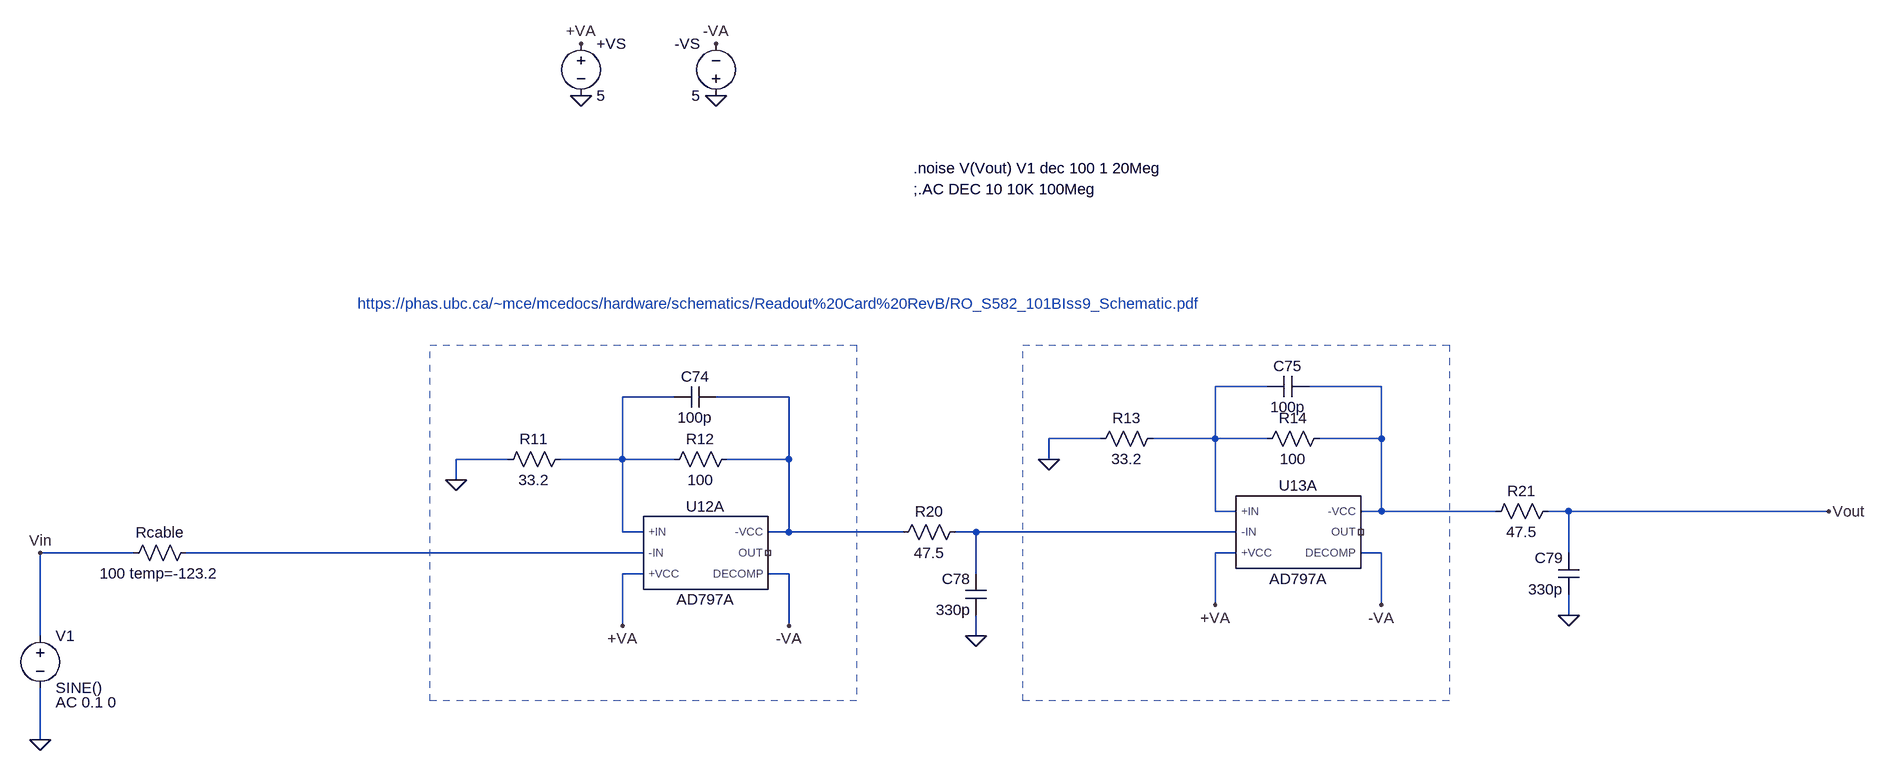
[diagram p0: schematic mce_rc_revb_frontend.asc]
mce_rc_revb_frontend.asc, the LTspice schematic file:
Version 4
SHEET 1 2228 836
WIRE 1296 112 1216 112
WIRE 1472 112 1360 112
WIRE 384 128 304 128
WIRE 560 128 448 128
WIRE 1040 192 960 192
WIRE 1216 192 1216 112
WIRE 1216 192 1120 192
WIRE 1296 192 1216 192
WIRE 1472 192 1472 112
WIRE 1472 192 1376 192
WIRE 128 224 48 224
WIRE 304 224 304 128
WIRE 304 224 208 224
WIRE 384 224 304 224
WIRE 560 224 560 128
WIRE 560 224 464 224
WIRE 960 224 960 192
WIRE 48 256 48 224
WIRE 1216 304 1216 192
WIRE 1248 304 1216 304
WIRE 1472 304 1472 192
WIRE 1472 304 1440 304
WIRE 1648 304 1472 304
WIRE 1760 304 1728 304
WIRE 2160 304 1760 304
WIRE 304 336 304 224
WIRE 336 336 304 336
WIRE 560 336 560 224
WIRE 560 336 528 336
WIRE 736 336 560 336
WIRE 848 336 816 336
WIRE 1248 336 848 336
WIRE -448 368 -592 368
WIRE 336 368 -368 368
WIRE 1248 368 1216 368
WIRE 1472 368 1440 368
WIRE 1760 368 1760 304
WIRE 336 400 304 400
WIRE 560 400 528 400
WIRE 848 400 848 336
WIRE 1216 448 1216 368
WIRE 1472 448 1472 368
WIRE 1760 464 1760 432
WIRE 304 480 304 400
WIRE 560 480 560 400
WIRE -592 496 -592 368
WIRE 848 496 848 464
WIRE -592 656 -592 576
FLAG -592 656 0
FLAG 48 256 0
FLAG 2160 304 Vout
FLAG -592 368 Vin
FLAG 240 -336 0
FLAG 448 -336 0
FLAG 240 -416 +VA
FLAG 448 -416 -VA
FLAG 304 480 +VA
FLAG 560 480 -VA
FLAG 848 496 0
FLAG 1216 448 +VA
FLAG 1472 448 -VA
FLAG 960 224 0
FLAG 1760 464 0
SYMBOL AutoGenerated/AD797A 432 368 R0
SYMATTR InstName U12A
SYMBOL voltage 240 -432 R0
SYMATTR InstName +VS
SYMATTR Value 5
SYMATTR SpiceLine Rser=0
SYMBOL voltage 448 -320 R180
WINDOW 0 24 96 Left 2
WINDOW 3 24 16 Left 2
SYMATTR InstName -VS
SYMATTR Value 5
SYMATTR SpiceLine Rser=0
SYMBOL voltage -592 480 R0
WINDOW 123 24 118 Left 2
SYMATTR Value2 AC 0.1 0
SYMATTR InstName V1
SYMATTR Value SINE()
SYMBOL res 224 208 R90
WINDOW 0 0 56 VBottom 2
WINDOW 3 32 56 VTop 2
SYMATTR InstName R11
SYMATTR Value 33.2
SYMBOL res 480 208 R90
WINDOW 0 0 56 VBottom 2
WINDOW 3 32 56 VTop 2
SYMATTR InstName R12
SYMATTR Value 100
SYMBOL cap 448 112 R90
WINDOW 0 0 32 VBottom 2
WINDOW 3 32 32 VTop 2
SYMATTR InstName C74
SYMATTR Value 100p
SYMBOL res -352 352 R90
WINDOW 0 0 56 VBottom 2
WINDOW 3 32 56 VTop 2
SYMATTR InstName Rcable
SYMATTR Value 100 temp=-123.2
SYMBOL res 832 320 R90
WINDOW 0 0 56 VBottom 2
WINDOW 3 32 56 VTop 2
SYMATTR InstName R20
SYMATTR Value 47.5
SYMBOL cap 864 464 R180
WINDOW 0 24 56 Left 2
WINDOW 3 24 8 Left 2
SYMATTR InstName C78
SYMATTR Value 330p
SYMBOL AutoGenerated/AD797A 1344 336 R0
SYMATTR InstName U13A
SYMBOL res 1136 176 R90
WINDOW 0 0 56 VBottom 2
WINDOW 3 32 56 VTop 2
SYMATTR InstName R13
SYMATTR Value 33.2
SYMBOL cap 1360 96 R90
WINDOW 0 0 32 VBottom 2
WINDOW 3 32 32 VTop 2
SYMATTR InstName C75
SYMATTR Value 100p
SYMBOL res 1392 176 R90
WINDOW 0 0 56 VBottom 2
WINDOW 3 32 56 VTop 2
SYMATTR InstName R14
SYMATTR Value 100
SYMBOL res 1744 288 R90
WINDOW 0 0 56 VBottom 2
WINDOW 3 32 56 VTop 2
SYMATTR InstName R21
SYMATTR Value 47.5
SYMBOL cap 1776 432 R180
WINDOW 0 24 56 Left 2
WINDOW 3 24 8 Left 2
SYMATTR InstName C79
SYMATTR Value 330p
TEXT 752 -192 Left 2 !;.AC DEC 10 10K 100Meg
TEXT 752 -224 Left 2 !.noise V(Vout) V1 dec 100 1 20Meg
TEXT -104 -16 Left 2 ;https://phas.ubc.ca/~mce/mcedocs/hardware/schematics/Readout%20Card%20RevB/RO_S582_101BIss9_Schematic.pdf
RECTANGLE Normal 8 48 664 596 2
RECTANGLE Normal 920 48 1576 596 2

The netlist it stands for:
* mce_rc_revb_frontend.asc
XU12A N003 N006 +VA N004 NC_01 -VA AD797A  ; pins +IN -IN +VCC -VCC OUT DECOMP
V§+VS +VA 0 5 Rser=0
V§-VS 0 -VA 5 Rser=0
V1 Vin 0 SINE() AC 0.1 0
R11 N003 0 33.2
R12 N004 N003 100
C74 N004 N003 100p
Rcable N006 Vin 100 temp=-123.2
R20 N005 N004 47.5
C78 0 N005 330p
XU13A N001 N005 +VA N002 NC_02 -VA AD797A  ; pins +IN -IN +VCC -VCC OUT DECOMP
R13 N001 0 33.2
C75 N002 N001 100p
R14 N002 N001 100
R21 Vout N002 47.5
C79 0 Vout 330p
;.AC DEC 10 10K 100Meg
.noise V(Vout) V1 dec 100 1 20Meg
* https://phas.ubc.ca/~mce/mcedocs/hardware/schematics/Readout%20Card%20RevB/RO_S582_101BIss9_Schematic.pdf
.lib /Users/shawn/Downloads/tdmspice/opamps/ad797a/ad797a.cir
.backanno
.end